# Altium schematic sheet Misc.SchDoc
size A4
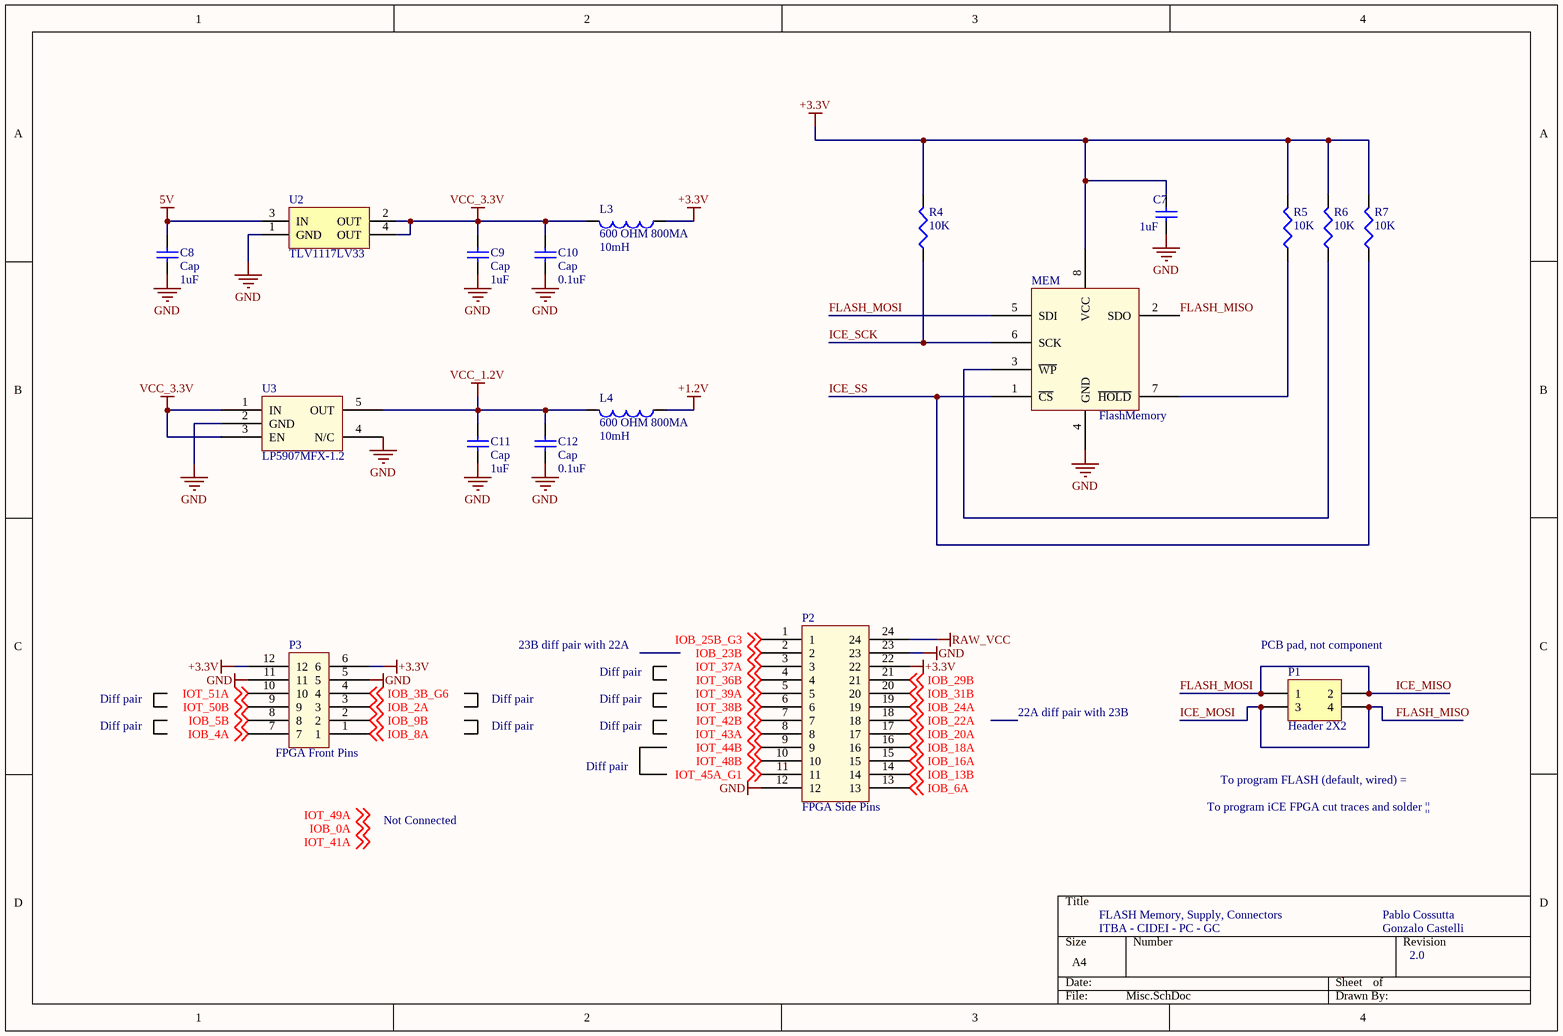
[diagram p0: Misc.SchDoc]

## Parts
C7  value 1uF  [C0402]  (hidden comment: Cap Semi)
C8  Cap  value 1uF  [C0603]
C9  Cap  value 1uF  [C0603]
C10  Cap  value 0.1uF  [C0402]
C11  Cap  value 1uF  [C0402]
C12  Cap  value 0.1uF  [C0402]
L3  600 OHM 800MA  value 10mH  [J1-0603]
L4  600 OHM 800MA  value 10mH  [J1-0603]
MEM  FlashMemory  [SOP8FlashCorrect]
P1  Header 2X2  [4x4HeaderSq]
P2  FPGA Side Pins  [FPGA Side Pins]
P3  FPGA Front Pins  [FPGA FRONT PINS]
R4  value 10K  [R0402]  (hidden comment: Res3)
R5  value 10K  [R0402]  (hidden comment: Res3)
R6  value 10K  [R0402]  (hidden comment: Res3)
R7  value 10K  [R0402]  (hidden comment: Res3)
U2  TLV1117LV33  [ZZ311]
U3  LP5907MFX-1.2  [1-2Regulator]

## Nets
5V: C8.2 U2.3(IN)
+1.2V: L4.1
+3.3V: C7.2 L3.1 MEM.8(VCC) P2.22 P3.6 P3.12 R4.2 R5.2 R6.2 R7.2
GND: C7.1 C8.1 C9.1 C10.1 C11.1 C12.1 MEM.4(GND) P2.12 P2.23 P3.5 P3.11 U2.1(GND) U3.2(GND) U3.4(N/C)
RAW_VCC: P2.24
VCC_1.2V: C11.2 C12.2 L4.2 U3.5(OUT)
VCC_3.3V: C9.2 C10.2 L3.2 U2.2(OUT) U2.4(OUT) U3.1(IN) U3.3(EN)
FLASH_MISO: MEM.2(SDO) P1.3 P1.4  [also labelled ICE_MOSI]
FLASH_MOSI: MEM.5(SDI) P1.1 P1.2  [also labelled ICE_MISO]
ICE_SCK: MEM.6(SCK) R4.1
ICE_SS: MEM.1(~{CS}) R7.1
IOB_2A: P3.3 ; off-sheet IOB_2A
IOB_3B_G6: P3.4 ; off-sheet IOB_3B_G6
IOB_4A: P3.7 ; off-sheet IOB_4A
IOB_5B: P3.8 ; off-sheet IOB_5B
IOB_6A: P2.13 ; off-sheet IOB_6A
IOB_8A: P3.1 ; off-sheet IOB_8A
IOB_9B: P3.2 ; off-sheet IOB_9B
IOB_13B: P2.14 ; off-sheet IOB_13B
IOB_16A: P2.15 ; off-sheet IOB_16A
IOB_18A: P2.16 ; off-sheet IOB_18A
IOB_20A: P2.17 ; off-sheet IOB_20A
IOB_22A: P2.18 ; off-sheet IOB_22A
IOB_23B: P2.2 ; off-sheet IOB_23B
IOB_24A: P2.19 ; off-sheet IOB_24A
IOB_25B_G3: P2.1 ; off-sheet IOB_25B_G3
IOB_29B: P2.21 ; off-sheet IOB_29B
IOB_31B: P2.20 ; off-sheet IOB_31B
IOT_36B: P2.4 ; off-sheet IOT_36B
IOT_37A: P2.3 ; off-sheet IOT_37A
IOT_38B: P2.6 ; off-sheet IOT_38B
IOT_39A: P2.5 ; off-sheet IOT_39A
IOT_42B: P2.7 ; off-sheet IOT_42B
IOT_43A: P2.8 ; off-sheet IOT_43A
IOT_44B: P2.9 ; off-sheet IOT_44B
IOT_45A_G1: P2.11 ; off-sheet IOT_45A_G1
IOT_48B: P2.10 ; off-sheet IOT_48B
IOT_50B: P3.9 ; off-sheet IOT_50B
IOT_51A: P3.10 ; off-sheet IOT_51A
NetMEM_3: MEM.3(~{WP}) R6.1
NetMEM_7: MEM.7(~{HOLD}) R5.1

## Notes on the sheet
- 23B diff pair with 22A
- (near P1) PCB pad, not component
- Diff pair
- 22A diff pair with 23B
- To program FLASH (default, wired) =
- Not Connected
- To program iCE FPGA cut traces and solder ||
- FLASH Memory, Supply, Connectors
- Pablo Cossutta
- ITBA - CIDEI - PC - GC
- Gonzalo Castelli
- 2.0
- Labels drawn without touching a wire or pin: IOB_0A, IOT_41A, IOT_49A

## Library data of the parts
C7 C11 = Cap Semi: Capacitor (Semiconductor SIM Model); Manufacturer: TDK Corporation; Manufacturer Part Number: CGB2A1JB1E105M033BC; Tolerance: ±20%; Voltage - Rated: 25V; Temperature Coefficient: JB; Notification: Current market demand for these product types have resulted in fluctuating and extending lead times. Lead times may differ.; Published: 8-Jun-2000; LatestRevisionDate: 29-May-2009; LatestRevisionNote: IPC-7351 Footprint Added.; PackageReference: C1206; Publisher: Altium Limited; PackageDescription: Chip Capacitor; Supplier 1: Digi-Key; Supplier Part Number 1: 445-12016-1-ND; RoHS: RoHS Compliant; Category: Capacitors; Stock 1: 0; Pricing 1: 1=0.25, 10=0.173, 100=0.0874, 500=0.0598, 1000=0.0529, 2500=0.0506, 5000=0.046 (USD); Packaging: Cut Tape (CT); Part Status: Active; Operating Temperature: -25°C ~ 85°C; Features: Low Profile; Ratings: -; Applications: General Purpose; Failure Rate: -; Mounting Type: Surface Mount, MLCC; Package / Case: 0402 (1005 Metric); Size / Dimension: 0.039" L x 0.020" W (1.00mm x 0.50mm); Height - Seated (Max): -; Thickness (Max): 0.013" (0.33mm); Lead Spacing: -; Lead Style: -; ComponentLink1URL: https://product.tdk.com/info/en/catalog/datasheets/mlcc_commercial_lowprofile_en.pdf; ComponentLink1Description: https://product.tdk.com/info/en/catalog/datasheets/mlcc_commercial_lowprofile_en.pdf
C8 C9 = Cap Semi: Capacitor (Semiconductor SIM Model); Manufacturer: Yageo; Manufacturer Part Number: CC0603KRX5R8BB105; Tolerance: ±10%; Voltage - Rated: 25V; Temperature Coefficient: X5R; Notification: Current market demand for these product types have resulted in fluctuating and extending lead times. Lead times may differ.; Published: 8-Jun-2000; LatestRevisionDate: 29-May-2009; LatestRevisionNote: IPC-7351 Footprint Added.; PackageReference: C1206; Publisher: Altium Limited; PackageDescription: Chip Capacitor; Supplier 1: Digi-Key; Supplier Part Number 1: 311-1445-1-ND; RoHS: RoHS Compliant; Category: Capacitors; Stock 1: 40000; Pricing 1: 1=0.25, 10=0.179, 100=0.0843, 500=0.05908, 1000=0.04891 (USD); Packaging: Cut Tape (CT); Part Status: Active; Operating Temperature: -55°C ~ 85°C; Features: -; Ratings: -; Applications: General Purpose; Failure Rate: -; Mounting Type: Surface Mount, MLCC; Package / Case: 0603 (1608 Metric); Size / Dimension: 0.063" L x 0.031" W (1.60mm x 0.80mm); Height - Seated (Max): -; Thickness (Max): 0.035" (0.90mm); Lead Spacing: -; Lead Style: -; ComponentLink1URL: http://www.yageo.com/documents/recent/UPY-GPHC_X5R_4V-to-50V_25.pdf; ComponentLink1Description: http://www.yageo.com/documents/recent/UPY-GPHC_X5R_4V-to-50V_25.pdf
C10 C12 = Cap Semi: Capacitor (Semiconductor SIM Model); Manufacturer: Samsung Electro-Mechanics; Manufacturer Part Number: CL05B104KA5NNNC; Tolerance: ±10%; Voltage - Rated: 25V; Temperature Coefficient: X7R; Notification: Current market demand for these product types have resulted in fluctuating and extending lead times. Lead times may differ.; Published: 8-Jun-2000; LatestRevisionDate: 29-May-2009; LatestRevisionNote: IPC-7351 Footprint Added.; PackageReference: C1206; Publisher: Altium Limited; PackageDescription: Chip Capacitor; Supplier 1: Digi-Key; Supplier Part Number 1: 1276-6720-1-ND; RoHS: RoHS Compliant; Category: Capacitors; Stock 1: 0; Pricing 1: 1=0.1, 10=0.071, 100=0.0317, 500=0.02262, 1000=0.01777, 2500=0.01616, 5000=0.01486 (USD); Packaging: Cut Tape (CT); Part Status: Active; Operating Temperature: -55°C ~ 125°C; Features: -; Ratings: -; Applications: General Purpose; Mounting Type: Surface Mount, MLCC; Package / Case: 0402 (1005 Metric); Size / Dimension: 0.039" L x 0.020" W (1.00mm x 0.50mm); Height - Seated (Max): -; Thickness (Max): 0.022" (0.55mm); Lead Spacing: -; Lead Style: -; ComponentLink1URL: http://www.samsungsem.com/kr/support/product-search/mlcc/CL05B104KA5NNNC.jsp; ComponentLink1Description: http://www.samsungsem.com/kr/support/product-search/mlcc/CL05B104KA5NNNC.jsp
L3 L4 = Inductor: Manufacturer: Murata Electronics North America; Manufacturer Part Number: BLM18HE601SN1D; Code_IEC: 1005; Filter Type: Signal Line; DC Resistance (DCR) (Max): 250 mOhm; Published: 8-Jun-2000; LatestRevisionDate: 29-May-2009; LatestRevisionNote: IPC-7351 Footprint Added.; PackageReference: 0402-A; Publisher: Altium Limited; PackageDescription: Chip Inductor; Code_JEITA: 0402; Supplier 1: Digi-Key; Supplier Part Number 1: 490-5214-1-ND; RoHS: RoHS Compliant; Category: Filters; Stock 1: 152784; Pricing 1: 1=0.22, 10=0.179, 25=0.1392, 50=0.1154, 100=0.0996, 250=0.07964, 500=0.07168, 1000=0.05973 (USD); Packaging: Cut Tape (CT); Part Status: Active; Current Rating (Max): 800mA; Ratings: -; Operating Temperature: -55°C ~ 125°C; Package / Case: 0603 (1608 Metric); Mounting Type: Surface Mount; Height (Max): 0.037" (0.95mm); Size / Dimension: 0.063" L x 0.032" W (1.60mm x 0.80mm); ComponentLink1URL: https://www.murata.com/en-us/products/productdata/8796741599262/ENFA0004.pdf; ComponentLink1Description: https://www.murata.com/en-us/products/productdata/8796741599262/ENFA0004.pdf
MEM = W25Q32JVSSIQ: IC FLASH 32M SPI 133MHZ 8SOIC; Manufacturer: Winbond Electronics; Memory Type: Non-Volatile; Write Cycle Time - Word, Page: 3ms; Voltage - Supply: 2.7 V ~ 3.6 V; Memory Interface: SPI - Quad I/O; Memory Size: 32Mb (4M x 8); Memory Format: FLASH; RoHS: RoHS Compliant; Manufacturer Part Number: W25Q32JVSSIQ; Technology: FLASH - NOR; Part Status: Active; Packaging: Tube; Category: Integrated Circuits (ICs); Supplier Device Package: 8-SOIC; Mounting Type: Surface Mount; Operating Temperature: -40°C ~ 85°C (TA); Package / Case: 8-SOIC (0.209", 5.30mm Width); ComponentLink1URL: http://www.winbond.com/resource-files/w25q32jv%20revg%2003272018%20plus.pdf; ComponentLink1Description: http://www.winbond.com/resource-files/w25q32jv%20revg%2003272018%20plus.pdf; Supplier 1: Digi-Key; Stock 1: 41181; Pricing 1: 1=0.81, 10=0.74, 25=0.7308, 90=0.72667, 180=0.64972, 270=0.64411, 540=0.63474, 810=0.62498, 1080=0.61183 (USD); Supplier Part Number 1: W25Q32JVSSIQ-ND
P1 = Header 2X2: Header, 2-Pin, Dual row; Not Populated: True; LatestRevisionDate: 17-Jul-2002; LatestRevisionNote: Re-released for DXP Platform.; Publisher: Altium Limited; Pricing 1: 0
R4-R7 = Res3: Resistor; Manufacturer: Yageo; Manufacturer Part Number: RC0402JR-0710KP; Tolerance: ±5%; Power (Watts): 0.063W, 1/16W; Temperature Coefficient: ±150ppm/°C; Published: 8-Jun-2000; LatestRevisionDate: 29-May-2009; LatestRevisionNote: IPC-7351 Footprint Added.; PackageReference: J1-0603; Publisher: Altium Limited; PackageDescription: Chip Resistor; Supplier 1: Digi-Key; Supplier Part Number 1: YAG1281CT-ND; RoHS: RoHS Compliant; Category: Resistors; Stock 1: 0; Pricing 1: 1=0.1, 10=0.028, 100=0.0119, 1000=0.00557, 2500=0.0049, 5000=0.00411 (USD); Packaging: Cut Tape (CT); Part Status: Active; Composition: Thick Film; Features: Moisture Resistant; Operating Temperature: -55°C ~ 155°C; Package / Case: 0402 (1005 Metric); Supplier Device Package: 0402; Size / Dimension: 0.039" L x 0.020" W (1.00mm x 0.50mm); Height - Seated (Max): 0.016" (0.40mm); Failure Rate: -; ComponentLink1URL: http://www.yageo.com/NewPortal/yageodocoutput?fileName=/pdf/R-Chip/PYu-RC_51_RoHS_P_0.pdf; ComponentLink1Description: http://www.yageo.com/NewPortal/yageodocoutput?fileName=/pdf/R-Chip/PYu-RC_51_RoHS_P_0.pdf
U2 = TLV1117LV33DCYR: IC REG LINEAR 3.3V 1A SOT223-4; Manufacturer: Texas Instruments; Output Configuration: Positive; Output Type: Fixed; Voltage - Input (Max): 5.5V; Voltage Dropout (Max): 1.3V @ 800mA; PSRR: 75dB (120Hz); Protection Features: Over Current, Over Temperature; ComponentLink1Description: http://www.ti.com/lit/ds/symlink/tlv1117lv.pdf; ComponentLink1URL: http://www.ti.com/lit/ds/symlink/tlv1117lv.pdf; Supplier 1: Digi-Key; Manufacturer Part Number: TLV1117LV33DCYR; RoHS: RoHS Compliant; Category: Integrated Circuits (ICs); Stock 1: 20855; Packaging: Cut Tape (CT); Part Status: Active; Voltage - Output (Min/Fixed): 3.3V; Voltage - Output (Max): -; Current - Output: 1A; Control Features: -; Operating Temperature: -40°C ~ 125°C; Mounting Type: Surface Mount; Package / Case: TO-261-4, TO-261AA; Supplier Device Package: SOT-223-4; Base Part Number: TLV1117LV33; Supplier Part Number 1: 296-28778-1-ND; Pricing 1: 1=0.68, 10=0.598, 100=0.4586, 500=0.36256, 1000=0.29005 (USD)
U3 = LP5907MFX-1.2/NOPB: IC REG LINEAR 1.2V 250MA SOT23-5; Manufacturer: Texas Instruments; Output Configuration: Positive; Output Type: Fixed; Voltage - Input (Max): 5.5V; Voltage Dropout (Max): 0.25V @ 250mA; PSRR: 90dB ~ 60dB (100Hz ~ 100kHz); Control Features: Enable; Protection Features: Over Temperature, Short Circuit; Supplier 1: Digi-Key; Manufacturer Part Number: LP5907MFX-1.2/NOPB; RoHS: RoHS Compliant; Category: Integrated Circuits (ICs); Stock 1: 65117; Packaging: Cut Tape (CT); Part Status: Active; Voltage - Output (Min/Fixed): 1.2V; Voltage - Output (Max): -; Current - Output: 250mA; Operating Temperature: -40°C ~ 125°C; Mounting Type: Surface Mount; Package / Case: SC-74A, SOT-753; Supplier Device Package: SOT-23-5; ComponentLink1URL: http://www.ti.com/lit/ds/symlink/lp5907.pdf; ComponentLink1Description: http://www.ti.com/lit/ds/symlink/lp5907.pdf; Supplier Part Number 1: 296-39062-1-ND; Pricing 1: 1=0.55, 10=0.475, 100=0.3547, 500=0.27872, 1000=0.21537 (USD)